# EAGLE design vswr_power_eagle (EAGLE 7.3.0)
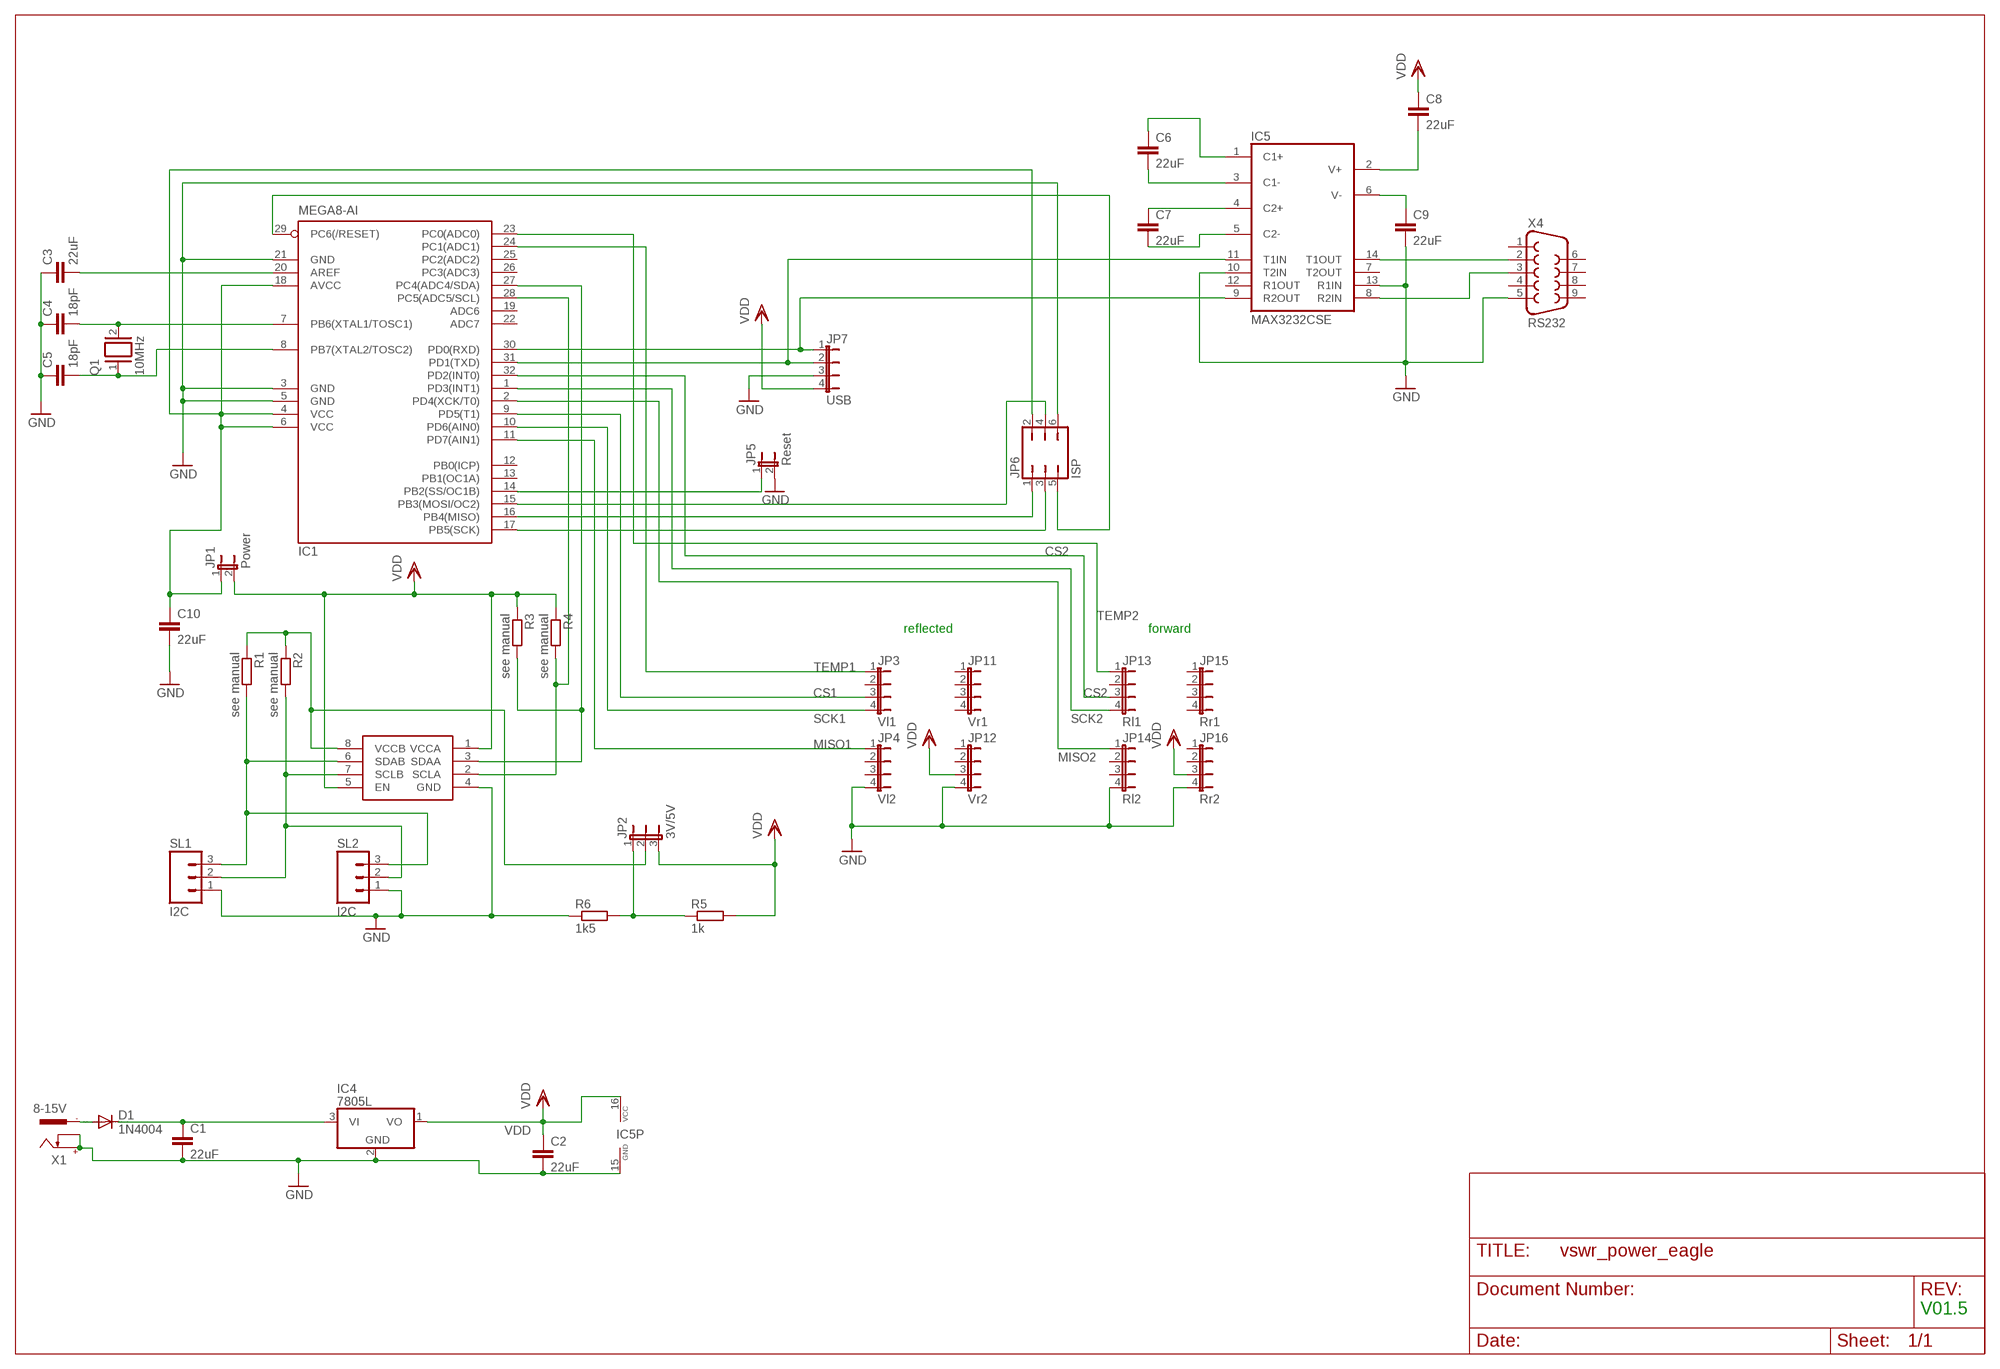
[diagram p0: schematic, sheet 1]

## Parts
C1  22uF  C-EUC1206  [C1206]
C2  22uF  C-EUC1206  [C1206]
C3  22uF  C-EUC1206  [C1206]
C4  18pF  C-EU025-025X050  [C025-025X050]
C5  18pF  C-EU025-025X050  [C025-025X050]
C6  22uF  C-EUC1206  [C1206]
C7  22uF  C-EUC1206  [C1206]
C8  22uF  C-EUC1206  [C1206]
C9  22uF  C-EUC1206  [C1206]
C10  22uF  C-EUC1206  [C1206]
D1  1N4004  [DO41-10]
IC1  MEGA8-AI  [TQFP32-08]
IC3  PCA9517  [SO-08]
IC4  7805L  [TO92]
IC5  MAX3232CSE  [SO16]
JP1  Power  JP1E  [JP1]
JP2  3V/5V  JP2E  [JP2]
JP3  Vl1  JP4E  [JP4]
JP4  Vl2  JP4E  [JP4]
JP5  Reset  JP1E  [JP1]
JP6  ISP  JP3Q  [JP3Q]
JP7  USB  JP4E  [JP4]
JP11  Vr1  JP4E  [JP4]
JP12  Vr2  JP4E  [JP4]
JP13  Rl1  JP4E  [JP4]
JP14  Rl2  JP4E  [JP4]
JP15  Rr1  JP4E  [JP4]
JP16  Rr2  JP4E  [JP4]
Q1  10MHz  XTAL/S  [QS]
R1  see manual  R-EU_R1206  [R1206]
R2  see manual  R-EU_R1206  [R1206]
R3  see manual  R-EU_R1206  [R1206]
R4  see manual  R-EU_R1206  [R1206]
R5  1k  R-EU_R1206  [R1206]
R6  1k5  R-EU_R1206  [R1206]
SL1  I2C  M03  [03P]
SL2  I2C  M03  [03P]
X1  8-15V  737992-55  [737992-5]
X4  RS232  F09H  [F09H]

## Nets
CS1: IC1.9(PD5(T1)) JP3.3
CS2: IC1.32(PD2(INT0)) JP13.3
GND: C1.2 C2.2 C3.1 C4.1 C5.1 C9.2 C10.2 IC1.3(GND) IC1.5(GND) IC1.21(GND) IC3.4(GND) IC4.2(GND) IC5.10(T2IN) IC5.13(R1IN) IC5.15(GND) JP4.4 JP5.2 JP6.6 JP7.3 JP12.4 JP14.4 JP16.4 R6.1 SL1.1 SL2.1 X1.+ X1.K X4.5
MISO1: IC1.11(PD7(AIN1)) JP4.1
MISO2: IC1.2(PD4(XCK/T0)) JP14.1
N$1: IC3.6(SDAB) R1.2 SL1.3 SL2.3
N$2: IC1.15(PB3(MOSI/OC2)) JP6.4
N$3: C1.1 D1.C IC4.3(VI)
N$4: IC3.8(VCCB) JP2.2 R1.1 R2.1
N$5: IC1.27(PC4(ADC4/SDA)) IC3.3(SDAA) R3.2
N$6: JP2.1 R5.1 R6.2
N$7: IC1.28(PC5(ADC5/SCL)) IC3.2(SCLA) R4.2
N$8: IC1.17(PB5(SCK)) JP6.3
N$10: IC1.31(PD1(TXD)) IC5.11(T1IN) JP7.2
N$11: IC1.14(PB2(SS/OC1B)) JP5.1
N$12: IC5.8(R2IN) X4.3
N$13: C3.2 IC1.20(AREF)
N$14: IC5.14(T1OUT) X4.2
N$15: IC1.16(PB4(MISO)) JP6.1
N$16: C8.2 IC5.2(V+)
N$17: C6.1 IC5.1(C1+)
N$18: IC1.29(PC6(/RESET)) JP6.5
N$19: C4.2 IC1.7(PB6(XTAL1/TOSC1)) Q1.2
N$20: C6.2 IC5.3(C1-)
N$21: C7.2 IC5.5(C2-)
N$22: IC3.7(SCLB) R2.2 SL1.2 SL2.2
N$23: C7.1 IC5.4(C2+)
N$24: C9.1 IC5.6(V-)
N$26: C10.1 IC1.4(VCC) IC1.6(VCC) IC1.18(AVCC) JP1.1 JP6.2
N$27: D1.A X1.-1
N$28: IC1.30(PD0(RXD)) IC5.9(R2OUT) JP7.1
N$37: C5.2 IC1.8(PB7(XTAL2/TOSC2)) Q1.1
SCK1: IC1.10(PD6(AIN0)) JP3.4
SCK2: IC1.1(PD3(INT1)) JP13.4
TEMP1: IC1.24(PC1(ADC1)) JP3.1
TEMP2: IC1.23(PC0(ADC0)) JP13.1
VDD: C2.1 C8.1 IC3.1(VCCA) IC3.5(EN) IC4.1(VO) IC5.16(VCC) JP1.2 JP2.3 JP7.4 JP12.3 JP16.3 R3.1 R4.1 R5.2
Unconnected: IC1.12(PB0(ICP)) IC1.13(PB1(OC1A)) IC1.19(ADC6) IC1.22(ADC7) IC1.25(PC2(ADC2)) IC1.26(PC3(ADC3)) IC5.7(T2OUT) IC5.12(R1OUT) JP3.2 JP4.2 JP4.3 JP11.1 JP11.2 JP11.3 JP11.4 JP12.1 JP12.2 JP13.2 JP14.2 JP14.3 JP15.1 JP15.2 JP15.3 JP15.4 JP16.1 JP16.2 X1.-2 X4.1 X4.4 X4.6 X4.7 X4.8 X4.9

## Notes on the sheet
- reflected | forward
- V01.5

## Library data of the parts
C1-C3 C6-C10 = rcl:C-EU: CAPACITOR, European symbol
C4 C5 = resistor:C-EU: CAPACITOR, European symbol
D1 = diode:1N4004: DIODE general purpose rectifier, 1 A
IC1 = atmel:MEGA8: MICROCONTROLLER 8 Kbytes FLASH, 1 kbytes SRAM, 512 bytes EEPROM, USART, 6-channel 10 bit ADC, 2-channel 8 bit ADC Pin compatible with Atmega48, ATMega88, ATMega168 Source: avr.lbr; MPN: ATMEGA8-16AU; OC_FARNELL: 9171371; OC_NEWARK: 73M8863
IC3 = PCA9517:PCA9517
IC4 = linear:78*: Positive VOLTAGE REGULATOR Source: http://cache.national.com/ds/LM/LM78L05.pdf http://www.fairchildsemi.com/ds/LM/LM7805.pdf
IC5 = maxim:MAX3232*: True RS-232 Transceivers 3.0V to 5.5V, Low-Power up to 1Mbps, Using Four 0.1µF External Capacitors Source: http://pdfserv.maxim-ic.com/en/ds/MAX3222-MAX3241.pdf; MPN: MAX3232CSE; OC_FARNELL: 9725490; OC_NEWARK: 90C2890
JP1 JP5 = jumper:JP1E: JUMPER
JP2 = jumper:JP2E: JUMPER
JP3 JP4 JP7 JP11-JP16 = jumper:JP4E: JUMPER
JP6 = jumper:JP3Q: JUMPER
Q1 = special:XTAL/S: CRYSTAL
R1-R6 = resistor:R-EU_: RESISTOR, European symbol
SL1 SL2 = con-amp-quick:M03: AMP QUICK CONNECTOR; OC_FARNELL: unknown; OC_NEWARK: unknown
X1 = con-conrad:737992-55: FEMALE PRINT CONNECTOR DIN 45323 (34V/3A), ROKA, distributor Conrad
X4 = con-subd:F09: SUB-D; OC_FARNELL: unknown; OC_NEWARK: unknown

## Board
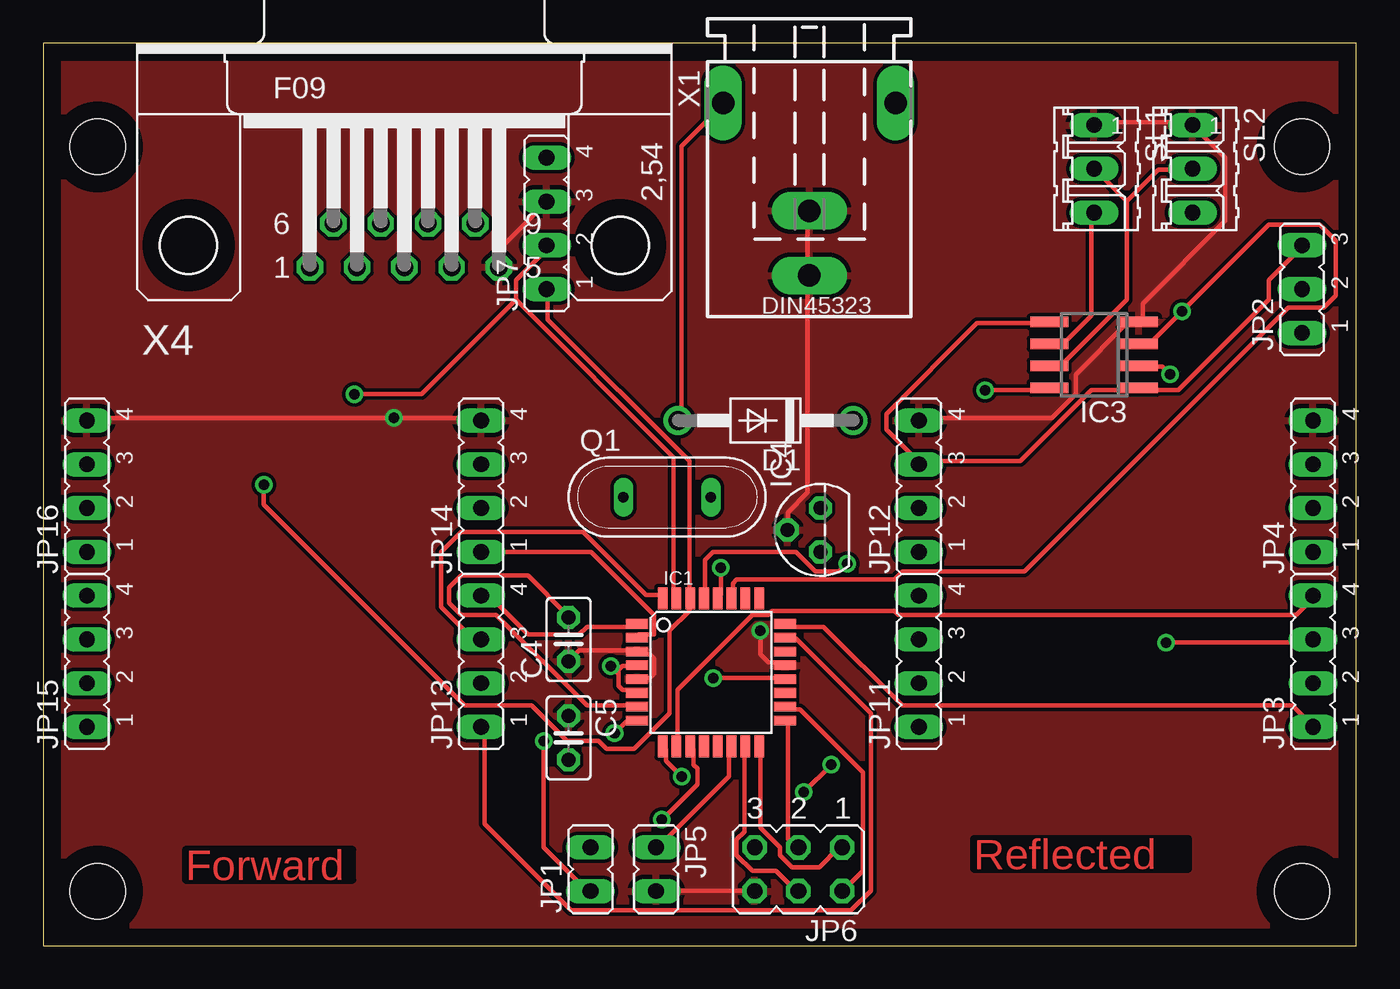
[diagram p1: board, top side]
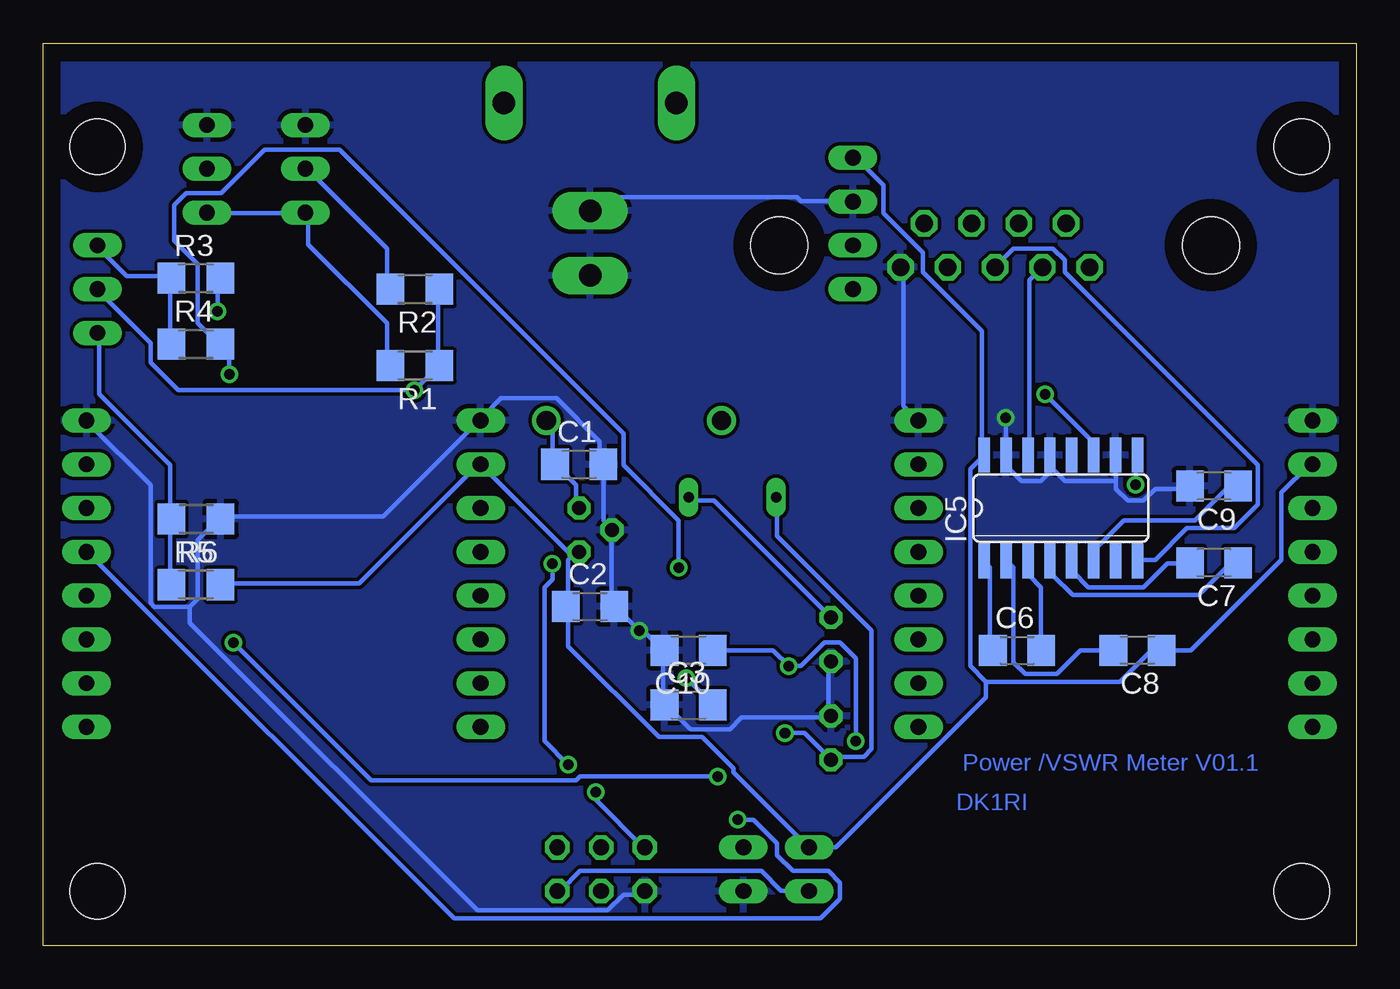
[diagram p2: board, bottom side, seen from below]

Size 76.18 x 52.38 mm. Coordinates in mm from the lower left corner, seen from the top.
Outline: 0,0 76.18,0 76.18,52.38 0,52.38 0,0
Copper layers (1*16): Top 0.035mm / dielectric 1.5mm / Bottom 0.035mm
Design rules "default": minimum track width 10mil, minimum drill 24mil, track to track 8mil, track to pad 8mil, pad to pad 8mil, via to via 8mil, smd to smd 8mil, copper to edge 40mil, drill to drill 8mil, minimum pad ring 10mil, minimum via ring 8mil, stop-mask expansion 4mil, vias tented up to drill 0mil, thermal gap 10mil
Holes 3.2 mm at 73.03,46.35 73.03,3.17 3.17,3.17 3.17,46.35

### Footprints (pad centres in the part's own frame; a part is rotated, then mirrored left to right if it is on the bottom)
C1206 = smd 1.6 x 1.8: 1 -1.4,0; 2 1.4,0
C025-025X050 = drill 0.813 octagon: 1 -1.27,0; 2 1.27,0
DO41-10 = drill 1.118: A 5.08,0; C -5.08,0
TQFP32-08 = smd 1.27 x 0.559: 1 -4.293,2.8; 2 -4.293,2; 3 -4.293,1.2; 4 -4.293,0.4; 5 -4.293,-0.4; 6 -4.293,-1.2; 7 -4.293,-2; 8 -4.293,-2.8; 17 4.293,-2.8; 18 4.293,-2; 19 4.293,-1.2; 20 4.293,-0.4; 21 4.293,0.4; 22 4.293,1.2; 23 4.293,2; 24 4.293,2.8 | smd 0.559 x 1.27: 9 -2.8,-4.293; 10 -2,-4.293; 11 -1.2,-4.293; 12 -0.4,-4.293; 13 0.4,-4.293; 14 1.2,-4.293; 15 2,-4.293; 16 2.8,-4.293; 25 2.8,4.293; 26 2,4.293; 27 1.2,4.293; 28 0.4,4.293; 29 -0.4,4.293; 30 -1.2,4.293; 31 -2,4.293; 32 -2.8,4.293
SO-08 = smd 0.6 x 2.2: 1 -1.905,-2.6; 2 -0.635,-2.6; 3 0.635,-2.6; 4 1.905,-2.6; 5 1.905,2.6; 6 0.635,2.6; 7 -0.635,2.6; 8 -1.905,2.6
TO92 = drill 0.813 octagon: 1 -1.27,0; 2 0,1.905; 3 1.27,0
SO16 = smd 0.66 x 2.032: 1 -4.445,-3.073; 2 -3.175,-3.073; 3 -1.905,-3.073; 4 -0.635,-3.073; 5 0.635,-3.073; 6 1.905,-3.073; 7 3.175,-3.073; 8 4.445,-3.073; 9 4.445,3.073; 10 3.175,3.073; 11 1.905,3.073; 12 0.635,3.073; 13 -0.635,3.073; 14 -1.905,3.073; 15 -3.175,3.073; 16 -4.445,3.073
JP1 = drill 0.914 long: 1 0,-1.27; 2 0,1.27
JP2 = drill 0.914 long: 1 -2.54,0; 2 0,0; 3 2.54,0
JP4 = drill 0.914 long: 1 -3.81,0; 2 -1.27,0; 3 1.27,0; 4 3.81,0
JP3Q = drill 0.914 octagon: 1 -2.54,-1.27; 2 -2.54,1.27; 3 0,-1.27; 4 0,1.27; 5 2.54,-1.27; 6 2.54,1.27
QS = drill 0.61 long: 1 -2.54,0; 2 2.54,0
R1206 = smd 1.6 x 1.803: 1 -1.422,0; 2 1.422,0
03P = drill 0.914 long: 1 -2.54,0; 2 0,0; 3 2.54,0
737992-5 = drill 1.3 pad 2.184 long: + 0,10; -1 5,0; -2 -5,0; K 0,6.25
F09H = drill 1.016 octagon: 1 -5.486,-1.27; 2 -2.743,-1.27; 3 0,-1.27; 4 2.743,-1.27; 5 5.486,-1.27; 6 -4.115,1.27; 7 -1.372,1.27; 8 1.372,1.27; 9 4.115,1.27 | hole 3.302: -12.522,0; 12.522,0

### Placement (x,y rotation side)
C1  45.09,27.94 0 bottom
C2  44.45,19.68 0 bottom
C3  38.73,13.97 0 bottom
C4  30.48,17.78 90 top
C5  30.48,12.06 270 top
C6  19.68,17.14 0 bottom
C7  8.26,22.23 180 bottom
C8  12.7,17.14 180 bottom
C9  8.26,26.67 180 bottom
C10  38.73,17.14 180 bottom
D1  41.91,30.48 180 top
IC1  38.73,15.88 0 top
IC3  60.96,34.29 90 top
IC4  45.09,24.13 90 top
IC5  17.14,25.4 0 bottom
JP1  31.75,4.45 0 top
JP2  73.03,38.1 90 top
JP3  73.66,16.51 90 top
JP4  73.66,26.67 90 top
JP5  35.56,4.45 180 top
JP6  43.81,4.45 180 top
JP7  29.21,41.91 90 top
JP11  50.8,16.51 90 top
JP12  50.8,26.67 90 top
JP13  25.4,16.51 90 top
JP14  25.4,26.67 90 top
JP15  2.54,16.51 90 top
JP16  2.54,26.67 90 top
Q1  36.2,26.04 0 top
R1  54.61,33.66 180 bottom
R2  54.61,38.1 180 bottom
R3  67.31,38.73 0 bottom
R4  67.31,34.92 0 bottom
R5  67.31,20.95 0 bottom
R6  67.31,24.77 180 bottom
SL1  60.96,45.09 270 top
SL2  66.67,45.09 270 top
X1  44.45,48.9 180 top
X4  20.95,40.64 0 top

### Tracks (layer width: path | path; a pad name or v marks a point on that pad's centre or on a via)
CS1  (via drill 0.61)
  Top 0.254: v37.03,9.83 36.12,10.74 36.12,11.43 IC1.9 | v65.15,17.6 73.61,17.6 JP3.3
  Bottom 0.254: v37.03,9.83 45.03,9.83 45.26,9.6 57.15,9.6 v65.15,17.6
CS2
  Top 0.254: IC1.32 35.89,20.34 34.98,20.34 31.32,24 24.23,24 23.09,22.86 23.09,19.66 24.92,17.83 25.38,17.83 JP13.3
GND  (via drill 0.61)
  Top 0.254: JP7.3 29.03,42.98 26.52,40.46 26.52,39.55 X4.5 | JP16.4 2.74,30.63 v20.34,30.63 25.38,30.63 JP14.4 | X1.K 44.35,42.52 44.35,39.09 X1.+ 44.35,38.86 44.35,26.29 43.2,25.15 43.2,24.23 IC4.2 | IC1.5 34.52,15.54 35.2,15.54 35.43,15.77 35.43,16.69 35.2,16.92 34.52,16.92 IC1.3 34.29,17.14 31.09,17.14 30.63,16.69 C4.1 | v41.6,18.29 41.6,16.92 42.06,16.46 42.98,16.46 IC1.21 | SL1.1 61.04,47.78 66.52,47.78 SL2.1 68.58,45.72 68.58,42.06 63.78,37.26 63.78,36.35 IC3.4 63.55,36.12 62.87,36.12 59.89,33.15 59.89,32 58.52,30.63 50.98,30.63 JP12.4 | JP5.2 35.66,3.2 41.15,3.2 JP6.6
  Bottom 0.254: 13.95,26.98 13.95,28.35 IC5.10 | 13.95,26.98 13.95,26.52 13.26,25.83 12.34,25.83 11.66,26.52 9.83,26.52 C9.2 | 17.6,27.66 17.6,28.35 IC5.13 17.6,27.66 | 17.6,27.66 16.92,26.98 13.95,26.98 | 17.6,27.66 18.29,26.98 19.43,26.98 20.12,27.66 20.12,28.35 IC5.15 20.34,28.57 v20.34,30.63 | X4.5 26.29,39.32 26.29,31.32 25.6,30.63 JP14.4 | C4.1 30.63,16.46 30.63,13.49 C5.1 30.63,13.26 35.66,13.26 36.35,12.57 38.63,12.57 40.01,13.95 C3.1 40.23,14.17 40.23,17.14 | 40.23,17.14 41.38,18.29 v41.6,18.29 42.98,19.66 C2.2 43.2,19.89 43.2,24 IC4.2 43.2,24.23 43.66,24.69 43.66,27.89 C1.2 43.89,28.12 43.89,29.26 46.41,31.77 49.61,31.77 50.75,30.63 JP12.4 50.98,30.4 56.46,24.92 65.84,24.92 R6.1 66.06,24.69 67.21,23.55 67.21,20.12 67.67,19.66 | 40.23,17.14 C10.2 | JP7.3 29.26,43.2 32.23,43.2 32.46,43.43 43.66,43.43 44.35,42.75 X1.K | 67.67,19.66 69.72,19.66 69.95,19.89 69.95,26.75 73.61,30.4 JP4.4 | 67.67,19.66 67.67,18.75 50.98,2.06 43.43,2.06 42.52,2.97 41.38,2.97 JP6.6
  pour Top: 0.64,51.44 75.56,51.44 75.56,0.64 0.64,0.64
  pour Bottom: 0.64,51.44 75.56,51.44 75.56,0.64 0.64,0.64
MISO1  (via drill 0.61)
  Top 0.254: v35.89,7.32 37.95,9.37 37.95,10.29 37.72,10.52 37.72,11.43 IC1.11
  Bottom 0.254: v35.89,7.32 34.98,7.32 33.6,5.94 33.6,5.26 32.69,4.34 30.63,4.34 29.95,3.66 29.95,2.74 31.09,1.6 52.35,1.6 73.61,22.86 JP4.1
MISO2
  Top 0.254: JP14.1 31.77,22.86 35.43,19.2 35.43,18.06 34.52,18.06 IC1.2
N$1
  Top 0.254: IC3.6 58.52,34.98 59.21,34.98 60.81,36.58 60.81,42.52 SL1.3
  Bottom 0.254: R1.2 56.24,33.83 56.24,36.12 60.81,40.69 60.81,42.52 SL1.3 61.04,42.52 66.52,42.52 SL2.3
N$2
  Top 0.254: IC1.15 40.69,11.43 40.69,6.63 40.23,6.17 40.23,5.26 41.15,4.34 42.52,4.34 43.66,3.2 JP6.4
N$3
  Bottom 0.254: D1.C 46.86,30.4 46.63,30.18 46.63,28.12 C1.1 46.41,27.89 45.26,26.75 45.26,25.6 IC4.3
N$4  (via drill 0.61)
  Top 0.254: v54.63,32.23 58.29,32.23 IC3.8
  Bottom 0.254: R2.1 53.26,37.95 53.26,33.83 R1.1 53.26,33.6 v54.63,32.23 68.35,32.23 69.95,33.83 69.95,34.98 72.92,37.95 JP2.2
N$5  (via drill 0.61)
  Top 0.254: IC1.27 40.01,20.34 40.01,21.03 40.23,21.26 49.38,21.26 49.84,21.72 56.92,21.72 72.24,37.03 74.3,37.03 74.98,37.72 74.98,40.92 74.07,41.83 71.09,41.83 v66.06,36.8 64.24,34.98 63.78,34.98 IC3.3
  Bottom 0.254: v66.06,36.8 66.06,38.63 R3.2
N$6
  Bottom 0.254: R5.1 68.81,21.03 68.81,24.69 R6.2 68.81,24.92 68.81,27.89 72.92,32 72.92,35.43 JP2.1
N$7  (via drill 0.61)
  Top 0.254: v39.32,21.95 39.32,20.34 IC1.28 | v65.38,33.15 64.92,33.6 63.78,33.6 IC3.2
  Bottom 0.254: v39.32,21.95 39.32,24.69 42.52,27.89 42.52,29.72 58.98,46.18 63.32,46.18 65.84,43.66 67.89,43.66 68.58,42.98 68.58,40.92 67.21,39.55 67.21,36.12 66.06,34.98 R4.2 65.84,34.75 65.38,34.29 v65.38,33.15
N$8
  Top 0.254: IC1.17 43.2,13.03 43.2,6.17 43.66,5.71 JP6.3
N$10  (via drill 0.61)
  Top 0.254: 27.43,37.49 36.58,28.35 36.58,20.34 IC1.31 | 27.43,37.49 27.43,38.63 29.26,40.46 JP7.2 | v18.06,32 21.95,32 27.43,37.49
  Bottom 0.254: v18.06,32 15.32,29.26 15.32,28.57 IC5.11
N$11
  Top 0.254: IC1.14 39.78,11.43 39.78,9.83 35.66,5.71 JP5.1
N$12
  Bottom 0.254: IC5.8 12.57,22.4 11.66,22.4 9.83,24.23 7.09,24.23 5.71,25.6 5.71,27.89 16.92,39.09 16.92,39.78 17.6,40.46 19.89,40.46 20.8,39.55 X4.3
N$13  (via drill 0.61)
  Top 0.254: v38.86,15.54 42.98,15.54 IC1.20
  Bottom 0.254: v38.86,15.54 37.49,14.17 C3.2
N$14
  Bottom 0.254: IC5.14 18.97,28.57 18.97,38.63 18.29,39.32 X4.2
N$15
  Top 0.254: IC1.16 41.6,11.43 41.6,6.86 42.75,5.71 42.75,5.26 43.43,4.57 45.03,4.57 46.18,5.71 JP6.1
N$16
  Bottom 0.254: C8.2 16,17.14 17.37,15.77 19.2,15.77 19.89,16.46 19.89,21.95 20.12,22.17 IC5.2
N$17
  Bottom 0.254: C6.1 21.26,17.14 21.26,21.95 21.49,22.17 IC5.1
N$18  (via drill 0.61)
  Top 0.254: v46.63,22.17 46.18,21.72 44.81,21.72 43.66,22.86 38.86,22.86 38.41,22.4 38.41,20.34 IC1.29 | v44.12,8.91 v45.72,10.52
  Bottom 0.254: v46.63,22.17 46.63,21.26 47.09,20.8 47.09,11.89 v45.72,10.52 | v44.12,8.91 44.12,8.46 41.38,5.71 JP6.5
N$19
  Top 0.254: IC1.7 34.29,13.95 31.55,13.95 26.29,19.2 24.23,19.2 23.55,19.89 23.55,20.8 24.23,21.49 28.12,21.49 30.4,19.2 C4.2
  Bottom 0.254: C4.2 37.26,25.83 38.63,25.83 Q1.2
N$20
  Bottom 0.254: C6.2 18.29,20.8 18.97,21.49 18.97,22.17 IC5.3
N$21
  Bottom 0.254: C7.2 9.83,22.17 10.97,22.17 12.34,20.8 15.54,20.8 16.46,21.72 16.46,22.17 IC5.5
N$22
  Top 0.254: 62.87,43.2 62.87,37.49 59.21,33.83 58.52,33.83 IC3.7 | 62.87,43.2 61.04,45.03 SL1.2 | 62.87,43.2 64.69,45.03 66.52,45.03 SL2.2
  Bottom 0.254: R2.2 56.24,38.18 56.24,40.46 60.81,45.03 SL1.2
N$23
  Bottom 0.254: C7.1 6.86,22.17 7.32,22.17 9.14,20.34 16.46,20.34 17.6,21.49 17.6,22.17 IC5.4
N$24
  Bottom 0.254: C9.1 6.86,26.52 7.54,26.52 9.37,24.69 13.49,24.69 15.09,23.09 15.09,22.4 IC5.6
N$26  (via drill 0.61)
  Top 0.254: 33.38,15.77 33.38,16 33.6,16.23 34.29,16.23 IC1.4 | 33.38,15.77 33.38,15.09 33.6,14.86 34.29,14.86 IC1.6 | 33.38,15.77 v32.92,16.23 | IC1.18 43.2,13.72 43.89,13.72 47.55,10.06 47.55,4.34 46.41,3.2 JP6.2 | v29.03,11.89 29.03,5.71 31.55,3.2 JP1.1
  Bottom 0.254: C10.1 33.83,17.14 v32.92,16.23 32.23,16.23 30.86,17.6 29.95,17.6 29.03,16.69 v29.03,11.89 | JP1.1 31.77,3.2 33.38,3.2 34.52,4.34 45.03,4.34 46.18,3.2 JP6.2
N$27
  Top 0.254: D1.A 37.03,30.63 37.03,46.41 39.32,48.69 X1.-1
N$28  (via drill 0.61)
  Top 0.254: JP7.1 29.26,37.95 29.26,36.35 37.49,28.12 37.49,20.34 IC1.30 37.49,20.12 37.49,19.43 36.35,18.29 36.35,13.49 34.29,11.43 32.69,11.43 32.23,11.89 30.4,11.89 28.35,13.95 24.46,13.95 12.8,25.6 v12.8,26.75
  Bottom 0.254: v12.8,26.75 12.8,28.35 IC5.9
N$37  (via drill 0.61)
  Top 0.254: v33.15,12.34 33.83,13.03 34.29,13.03 IC1.8
  Bottom 0.254: v33.15,12.34 32,12.34 30.63,10.97 C5.2 30.4,10.97 28.57,10.97 28.12,11.43 28.12,18.29 33.6,23.77 33.6,25.83 Q1.1
SCK1
  Top 0.254: IC1.10 36.8,11.66 36.8,14.86 41.15,19.2 42.06,19.2 42.29,19.43 49.38,19.43 49.61,19.2 72.69,19.2 73.61,20.12 JP3.4
SCK2
  Top 0.254: IC1.1 34.29,18.52 31.55,18.52 31.09,18.06 28.12,18.06 26.06,20.12 25.6,20.12 JP13.4
TEMP1
  Top 0.254: IC1.24 43.2,18.52 45.26,18.52 49.84,13.95 72.47,13.95 73.61,12.8 JP3.1
TEMP2
  Top 0.254: IC1.23 43.2,17.83 43.66,17.83 48.01,13.49 48.01,3.2 46.86,2.06 30.63,2.06 25.6,7.09 25.6,12.57 JP13.1
VDD
  Top 0.254: JP2.3 72.92,40.46 71.09,38.63 71.09,37.49 65.84,32.23 63.78,32.23 IC3.1 63.55,32.23 60.81,32.23 56.69,28.12 50.98,28.12 JP12.3 50.75,28.12 48.92,29.95 48.92,30.86 54.18,36.12 58.29,36.12 IC3.5
  Bottom 0.254: JP16.3 2.74,27.89 4.34,26.29 4.34,22.4 9.6,17.14 C8.1 11.89,17.14 13.72,15.32 21.49,15.32 | JP7.4 29.03,45.72 27.43,44.12 27.43,42.52 25.15,40.23 25.15,39.09 21.72,35.66 21.72,28.57 IC5.16 22.4,27.66 22.4,16.23 21.49,15.32 | 45.49,22.63 45.26,22.86 IC4.1 45.49,22.63 | 45.49,22.63 45.72,22.4 45.72,19.89 C2.1 45.72,19.66 45.72,17.37 40.46,12.12 37.95,12.12 36.12,10.29 36.12,10.06 31.77,5.71 JP1.2 30.18,5.71 21.49,14.4 21.49,15.32 | R4.1 68.81,34.98 68.81,38.63 R3.1 68.81,38.86 71.32,38.86 72.92,40.46 JP2.3 | R5.2 65.84,21.03 57.84,21.03 50.98,27.89 JP12.3 45.49,22.63

### Text on the board
Top: Forward | Reflected
Bottom: Power /VSWR Meter V01.1 | DK1RI